# EAGLE design power_monitor (EAGLE 6.4)
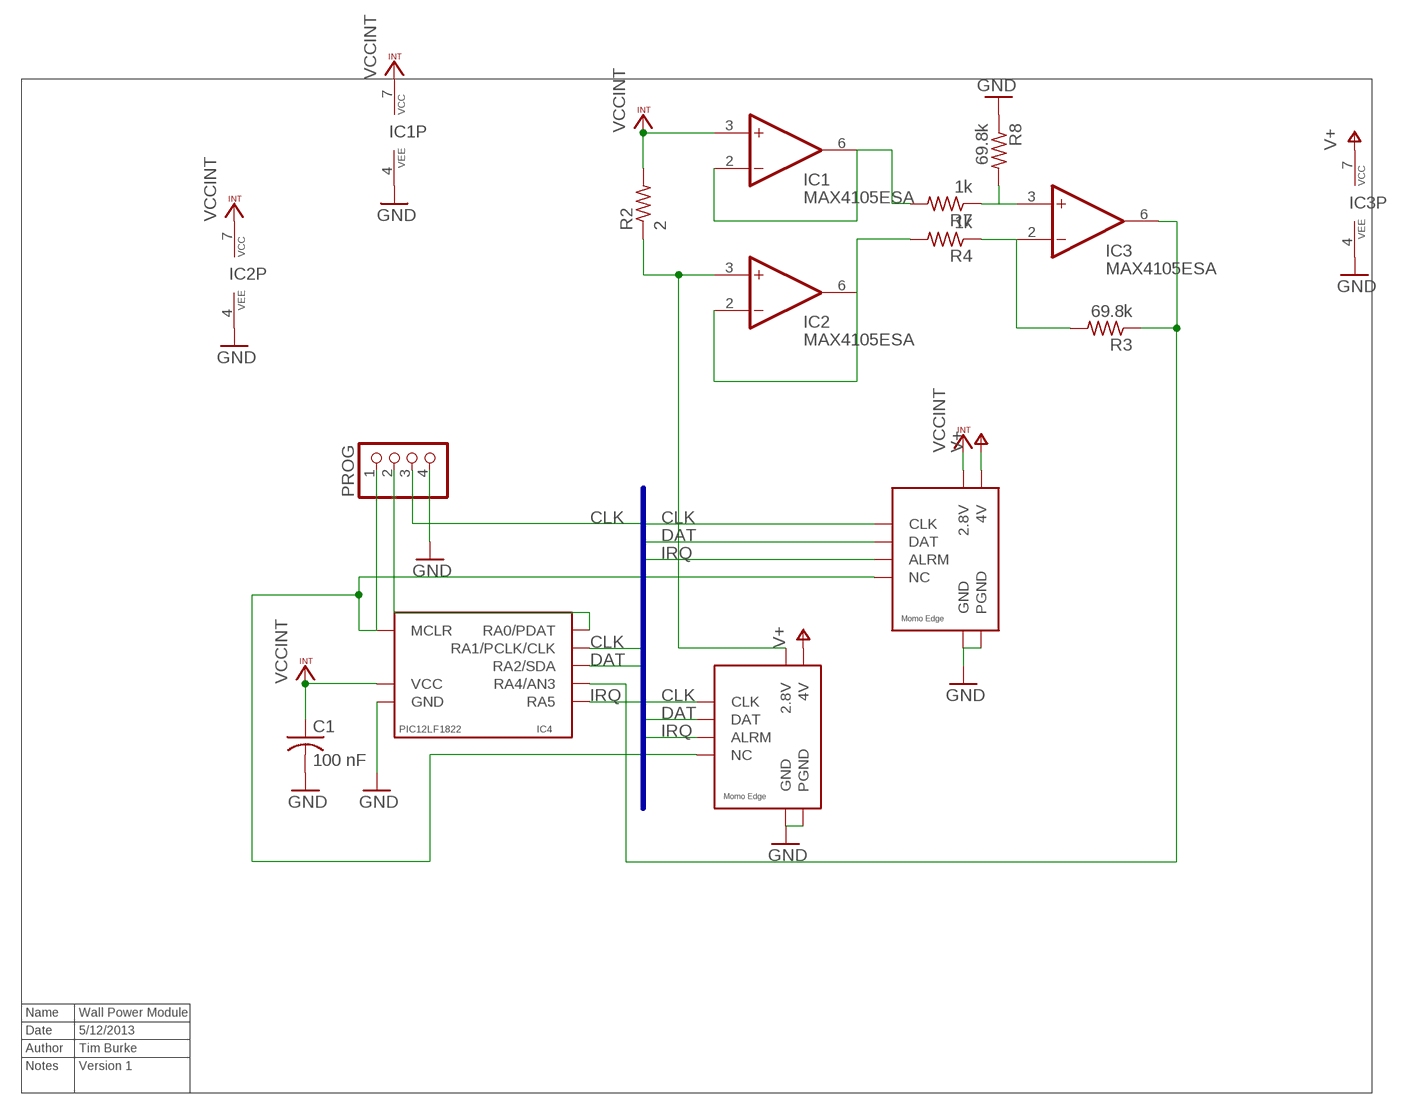
[diagram p0: schematic, sheet 1]

## Parts
C1  100 nF  C-USC0402  [C0402]
IC1  MAX4105ESA  [SO08]
IC2  MAX4105ESA  [SO08]
IC3  MAX4105ESA  [SO08]
IC4  PIC12LF1822  [SOIC8]
PROG  PINHD-1X4  [1X04]
R2  2  R-US_R0603  [R0603]
R3  69.8k  R-US_R0603  [R0603]
R4  1k  R-US_R0603  [R0603]
R7  1k  R-US_R0603  [R0603]
R8  69.8k  R-US_R0603  [R0603]
U$6  MOMO-EDGE-8F  [MOMO-EDGE-8F]
U$7  MOMO-EDGE-8M  [MOMO-EDGE-8M]

## Nets
CLK: IC4.6(RA1/PCLK/CLK) PROG.3 U$6.CLK U$7.CLK
DAT: IC4.5(RA2/SDA) U$6.DAT U$7.DAT
GND: C1.2 IC1.4(VEE) IC2.4(VEE) IC3.4(VEE) IC4.8(GND) PROG.4 R8.1 U$6.GND U$6.PGND U$7.GND U$7.PGND
IRQ: IC4.2(RA5) U$6.ARLM(ALRM) U$7.ALRM
N$1: IC4.4(MCLR) PROG.1 U$6.NV(NC) U$7.NC
N$2: IC3.6(OUT) IC4.3(RA4/AN3) R3.1
N$3: IC2.2(-IN) IC2.6(OUT) R4.2
N$4: IC1.2(-IN) IC1.6(OUT) R7.2
N$7: IC3.2(-IN) R3.2 R4.1
N$8: IC4.7(RA0/PDAT) PROG.2
N$9: IC3.3(+IN) R7.1 R8.2
N$11: IC2.3(+IN) R2.1 U$7.V28(2.8V)
V+: IC3.7(VCC) U$6.V4.(4V) U$7.V4(4V)
VCCINT: C1.1 IC1.3(+IN) IC1.7(VCC) IC2.7(VCC) IC4.1(VCC) R2.2 U$6.V28(2.8V)
Unconnected: IC1.1(NC) IC1.5(NC) IC1.8(NC) IC2.1(NC) IC2.5(NC) IC2.8(NC) IC3.1(NC) IC3.5(NC) IC3.8(NC)

## Buses
PICBUS:CLK,DAT,IRQ

## Notes on the sheet
- Name | Wall Power Module
- Date | 5/12/2013
- Author | Tim Burke
- Notes | Version 1

## Library data of the parts
C1 = rcl:C-US: CAPACITOR, American symbol
IC1-IC3 = maxim:MAX4105ESA: OP AMP; MPN: MAX4105ESA+; OC_FARNELL: unknown; OC_NEWARK: 67K5150
IC4 = components:PIC12LF1822
PROG = pinhead:PINHD-1X4: PIN HEADER
R2-R4 R7 R8 = rcl:R-US_: RESISTOR, American symbol
U$6 = components:MOMO-EDGE-8F
U$7 = components:MOMO-EDGE-8M

## Board
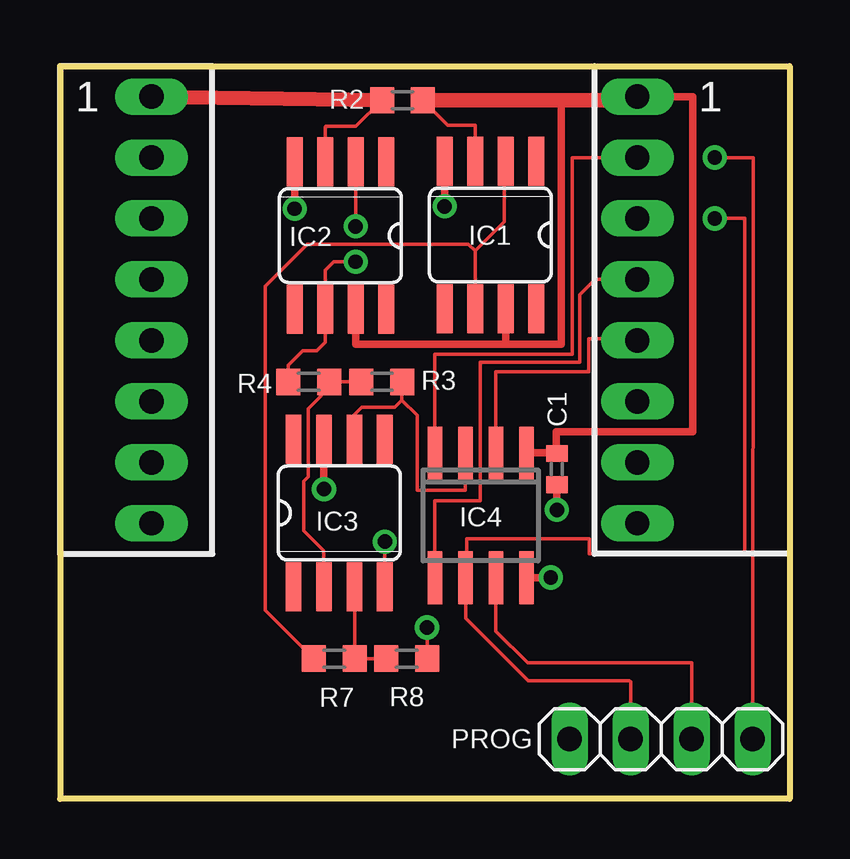
[diagram p1: board, top side]
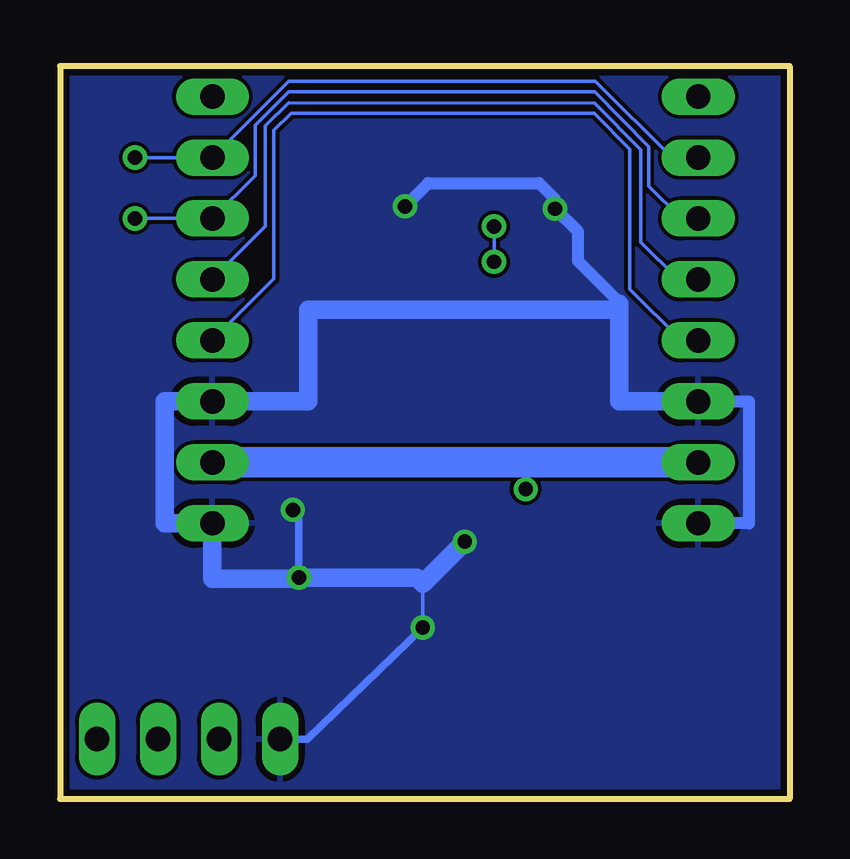
[diagram p2: board, bottom side, seen from below]

Size 30.4 x 30.53 mm. Coordinates in mm from the lower left corner, seen from the top.
Outline: 0,30.53 30.4,30.53 30.4,0 0,0 0,30.53
Copper layers (1*16): Top 0.035mm / dielectric 1.5mm / Bottom 0.035mm
Design rules "default *": minimum track width 6mil, minimum drill 19mil, track to track 6mil, track to pad 6mil, pad to pad 6mil, via to via 6mil, smd to smd 6mil, copper to edge 10mil, drill to drill 8mil, minimum pad ring 10mil, minimum via ring 8mil, stop-mask expansion 4mil, vias tented up to drill 0mil, thermal gap 10mil

### Footprints (pad centres in the part's own frame; a part is rotated, then mirrored left to right if it is on the bottom)
C0402 = smd 0.7 x 0.9: 1 -0.65,0; 2 0.65,0
SO08 = smd 0.66 x 2.032: 1 -1.905,-3.073; 2 -0.635,-3.073; 3 0.635,-3.073; 4 1.905,-3.073; 5 1.905,3.073; 6 0.635,3.073; 7 -0.635,3.073; 8 -1.905,3.073
SOIC8 = smd 0.6 x 2.2: 1 -1.905,-2.6; 2 -0.635,-2.6; 3 0.635,-2.6; 4 1.905,-2.6; 5 1.905,2.6; 6 0.635,2.6; 7 -0.635,2.6; 8 -1.905,2.6
1X04 = drill 1.016 long: 1 -3.81,0; 2 -1.27,0; 3 1.27,0; 4 3.81,0
R0603 = smd 1 x 1.1: 1 -0.85,0; 2 0.85,0
MOMO-EDGE-8F = drill 1.016 long: ARLM 0,0; CLK 0,5.08; DAT 0,2.54; GND 0,-2.54; NV 0,7.62; PGND 0,-7.62; V4. 0,-5.08; V28 0,10.16
MOMO-EDGE-8M = drill 1.016 long: ALRM 0,0; CLK 0,5.08; DAT 0,2.54; GND 0,-2.54; NC 0,7.62; PGND 0,-7.62; V4 0,-5.08; V28 0,10.16

### Placement (x,y rotation side)
C1  20.7,13.74 270 top
IC1  17.93,23.5 180 top
IC2  11.68,23.47 180 top
IC3  11.63,11.91 0 top
IC4  17.53,11.81 180 top
PROG  25.04,2.49 180 top
R2  14.27,29.11 0 top
R3  13.41,17.37 180 top
R4  10.36,17.37 180 top
R7  11.43,5.84 180 top
R8  14.45,5.84 180 top
U$6  24.05,19.1 0 top
U$7  3.81,19.1 0 top

### Tracks (layer width: path | path; a pad name or v marks a point on that pad's centre or on a via)
CLK  (via drill 0.6)
  Top 0.152: PROG.3 23.77,4.88 23.72,4.93 19.51,4.93 16.92,7.52 16.92,9.21 IC4.6 16.94,9.21 16.94,10.85 22.05,10.85 22.05,10.21 28.52,10.21 28.52,24.18 v27.28,24.18
  Bottom 0.152: U$7.CLK 4.55,24.21 5.87,25.53 5.87,27.18 8.13,29.46 20.88,29.46 22.28,28.07 22.28,25.96 U$6.CLK v27.28,24.18
DAT
  Top 0.152: U$6.DAT 22.3,21.64 21.67,21.01 21.67,18.19 17.5,18.19 17.5,12.42 15.62,12.42 IC4.5
  Bottom 0.152: U$7.DAT 4.67,21.67 6.2,23.19 6.2,27.05 8.13,28.98 20.88,29.01 21.84,28.04 21.84,23.85 U$6.DAT
GND  (via drill 0.6)
  Top 0.152: R8.1 15.3,7.13 v15.29,7.14 | v13.54,10.72 IC3.4
  Top 0.305: IC2.4 v9.78,24.59 | IC1.4 v16.03,24.69 | IC4.8 20.33,9.21 v20.45,9.22 | C1.2 v20.7,12.04
  Bottom 0.152: v15.29,7.14 15.29,8.97 | 19.99,20.37 20.07,20.37 | 20.07,16.51 20.07,16.56
  Bottom 0.305: 9.78,24.99 v9.78,24.59 | 7.11,20.7 7.11,20.62 7.37,20.37 | v15.29,7.14 20.09,2.49 PROG.4 | U$6.PGND 24.05,11.4 | 20.5,9.17 v20.45,9.22 20.45,11.79 v20.7,12.04 | 15.29,8.97 15.54,9.22
  Bottom 0.508: v16.03,24.69 15.06,25.65 10.44,25.65 9.78,24.99 | 7.11,20.7 8.81,22.4 8.81,23.62 v9.78,24.59 | U$7.GND 1.7,16.56 1.7,11.48 U$7.PGND
  Bottom 0.762: 15.29,8.97 v13.54,10.72 | U$7.GND 4.8,16.59 | 7.11,20.62 7.11,18.92 7.11,16.56 4.8,16.56 | 19.99,20.37 7.37,20.37 | 20.5,9.17 21.82,9.17 24.05,9.17 U$6.PGND 26.04,11.48 26.04,16.56 U$6.GND 20.07,16.56 20.07,20.37 | 15.54,9.22 v20.45,9.22
  pour Bottom: -15.72,0 -15.72,30.48 30.48,30.48 30.48,0
IRQ
  Top 0.152: IC4.2 18.16,17.8 22.02,17.8 22.02,19.18 24.05,19.18 U$6.ARLM
  Bottom 0.152: U$7.ALRM 4.55,19.13 6.65,21.23 6.65,27.08 8.15,28.57 20.78,28.57 21.49,27.86 21.49,21.67 U$6.ARLM
N$1  (via drill 0.6)
  Top 0.152: U$6.NV 21.34,26.72 21.34,18.52 15.62,18.52 IC4.4 | PROG.1 28.88,26.72 v27.28,26.72
  Top 0.305: IC4.4 15.62,14.53 15.54,14.53
  Bottom 0.152: U$7.NC 4.9,26.72 8.1,29.9 20.88,29.9 U$6.NV v27.28,26.72
N$2
  Top 0.152: IC3.6 12.27,16 12.57,16.31 13.94,16.31 14.25,16.61 | 14.25,16.61 R3.1 | 14.25,16.61 14.88,15.98 14.88,12.85 16.89,12.85 IC4.3
N$3  (via drill 0.6)
  Top 0.152: IC2.2 v12.32,23.85 | v12.32,22.38 11.4,22.38 11.05,22.02 IC2.6 11.05,19.02 10.69,18.67 10.11,18.67 9.51,18.07 R4.2
  Bottom 0.152: v12.32,23.85 v12.32,22.38
N$4
  Top 0.152: IC1.2 18.52,26.52 18.52,24.05 17.3,22.84 | IC1.6 17.3,22.84 | 17.3,22.84 17.02,23.11 10.31,23.11 8.56,21.36 8.56,7.86 R7.2
N$7
  Top 0.152: 11.46,17.37 R3.2 | R4.1 11.46,17.37 | IC3.2 11,10.34 10.16,11.18 10.16,13.23 10.34,13.41 10.34,16.26 11.46,17.37
N$8
  Top 0.152: IC4.7 18.16,6.99 19.48,5.66 26.31,5.66 PROG.2
N$9
  Top 0.152: IC3.3 12.28,8.83 R7.1 R8.2
N$11
  Top 0.152: IC2.3 11.05,27.99 11.07,28.02 12.33,28.02 R2.1
  Top 0.61: U$7.V28 R2.1
V+  (via drill 0.6)
  Top 0.305: IC3.7 v11,12.9
  Bottom 0.305: v11,12.9 11,14.02
  Bottom 1.27: U$7.V4 11,14.02 U$6.V4.
VCCINT
  Top 0.152: IC1.3 17.3,28.07 16.17,28.07 R2.2
  Top 0.305: IC2.7 12.32,18.95 18.57,18.95 | 18.57,18.95 20.88,18.95 20.88,29.01 20.98,29.11 | IC1.7 18.57,18.95 | IC4.1 20.68,14.41 | 20.68,14.41 C1.1 | 20.68,14.41 20.68,15.29 26.37,15.29 26.37,29.26 U$6.V28
  Top 0.61: U$6.V28 24.05,29.11 20.98,29.11 R2.2